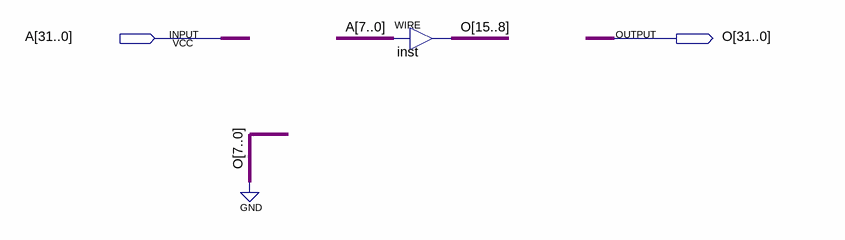
[diagram p0: schematic sheet]
// Quartus schematic SLL8.bdf as structural Verilog: 1 symbols, 2 pins
module SLL8 (
  input  [31:0] A,
  output [31:0] O
);

  assign O[15:8] = A[7:0];  // WIRE inst

  assign O[7:0] = {8{1'b0}};
endmodule
